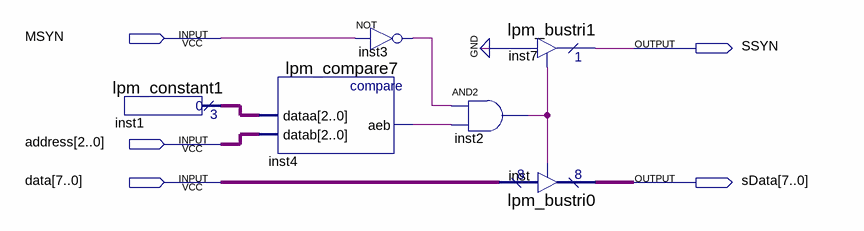
[diagram p0: schematic sheet]
// Quartus schematic Slave1.bdf as structural Verilog: 6 symbols, 5 pins
module Slave1 (
  input  MSYN,
  input  [2:0] address,
  input  [7:0] data,
  output SSYN,
  output [7:0] sData
);

  wire inst2_out, inst3_out, inst4_aeb;
  wire [2:0] inst1_result;

  lpm_constant1 inst1 (.result(inst1_result));
  lpm_compare7 inst4 (.dataa(inst1_result), .datab(address), .aeb(inst4_aeb));
  not inst3 (inst3_out, MSYN);
  lpm_bustri1 inst7 (.enabledt(inst2_out), .data(1'b0), .tridata(SSYN));
  and inst2 (inst2_out, inst3_out, inst4_aeb);
  lpm_bustri0 inst (.enabledt(inst2_out), .data(data), .tridata(sData));
endmodule
